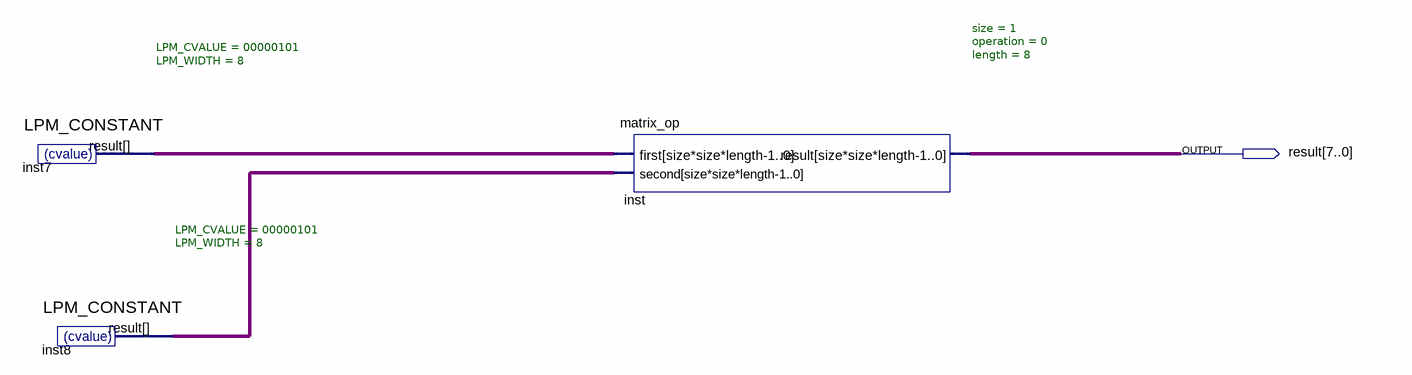
[diagram p0: schematic sheet]
// Quartus schematic Homework.bdf as structural Verilog: 3 symbols, 1 pins
module Homework (
  output [7:0] result
);

  wire [7:0] inst7_result, inst8_result;

  LPM_CONSTANT #(.LPM_CVALUE(00000101), .LPM_WIDTH(8)) inst7 (.result(inst7_result));
  LPM_CONSTANT #(.LPM_CVALUE(00000101), .LPM_WIDTH(8)) inst8 (.result(inst8_result));
  matrix_op #(.size(1), .operation(0), .length(8)) inst (.first(inst7_result), .second(inst8_result), .result(result));
endmodule
